# EAGLE design TOP_BEE_Brother_1.3v (EAGLE 6.5.0)
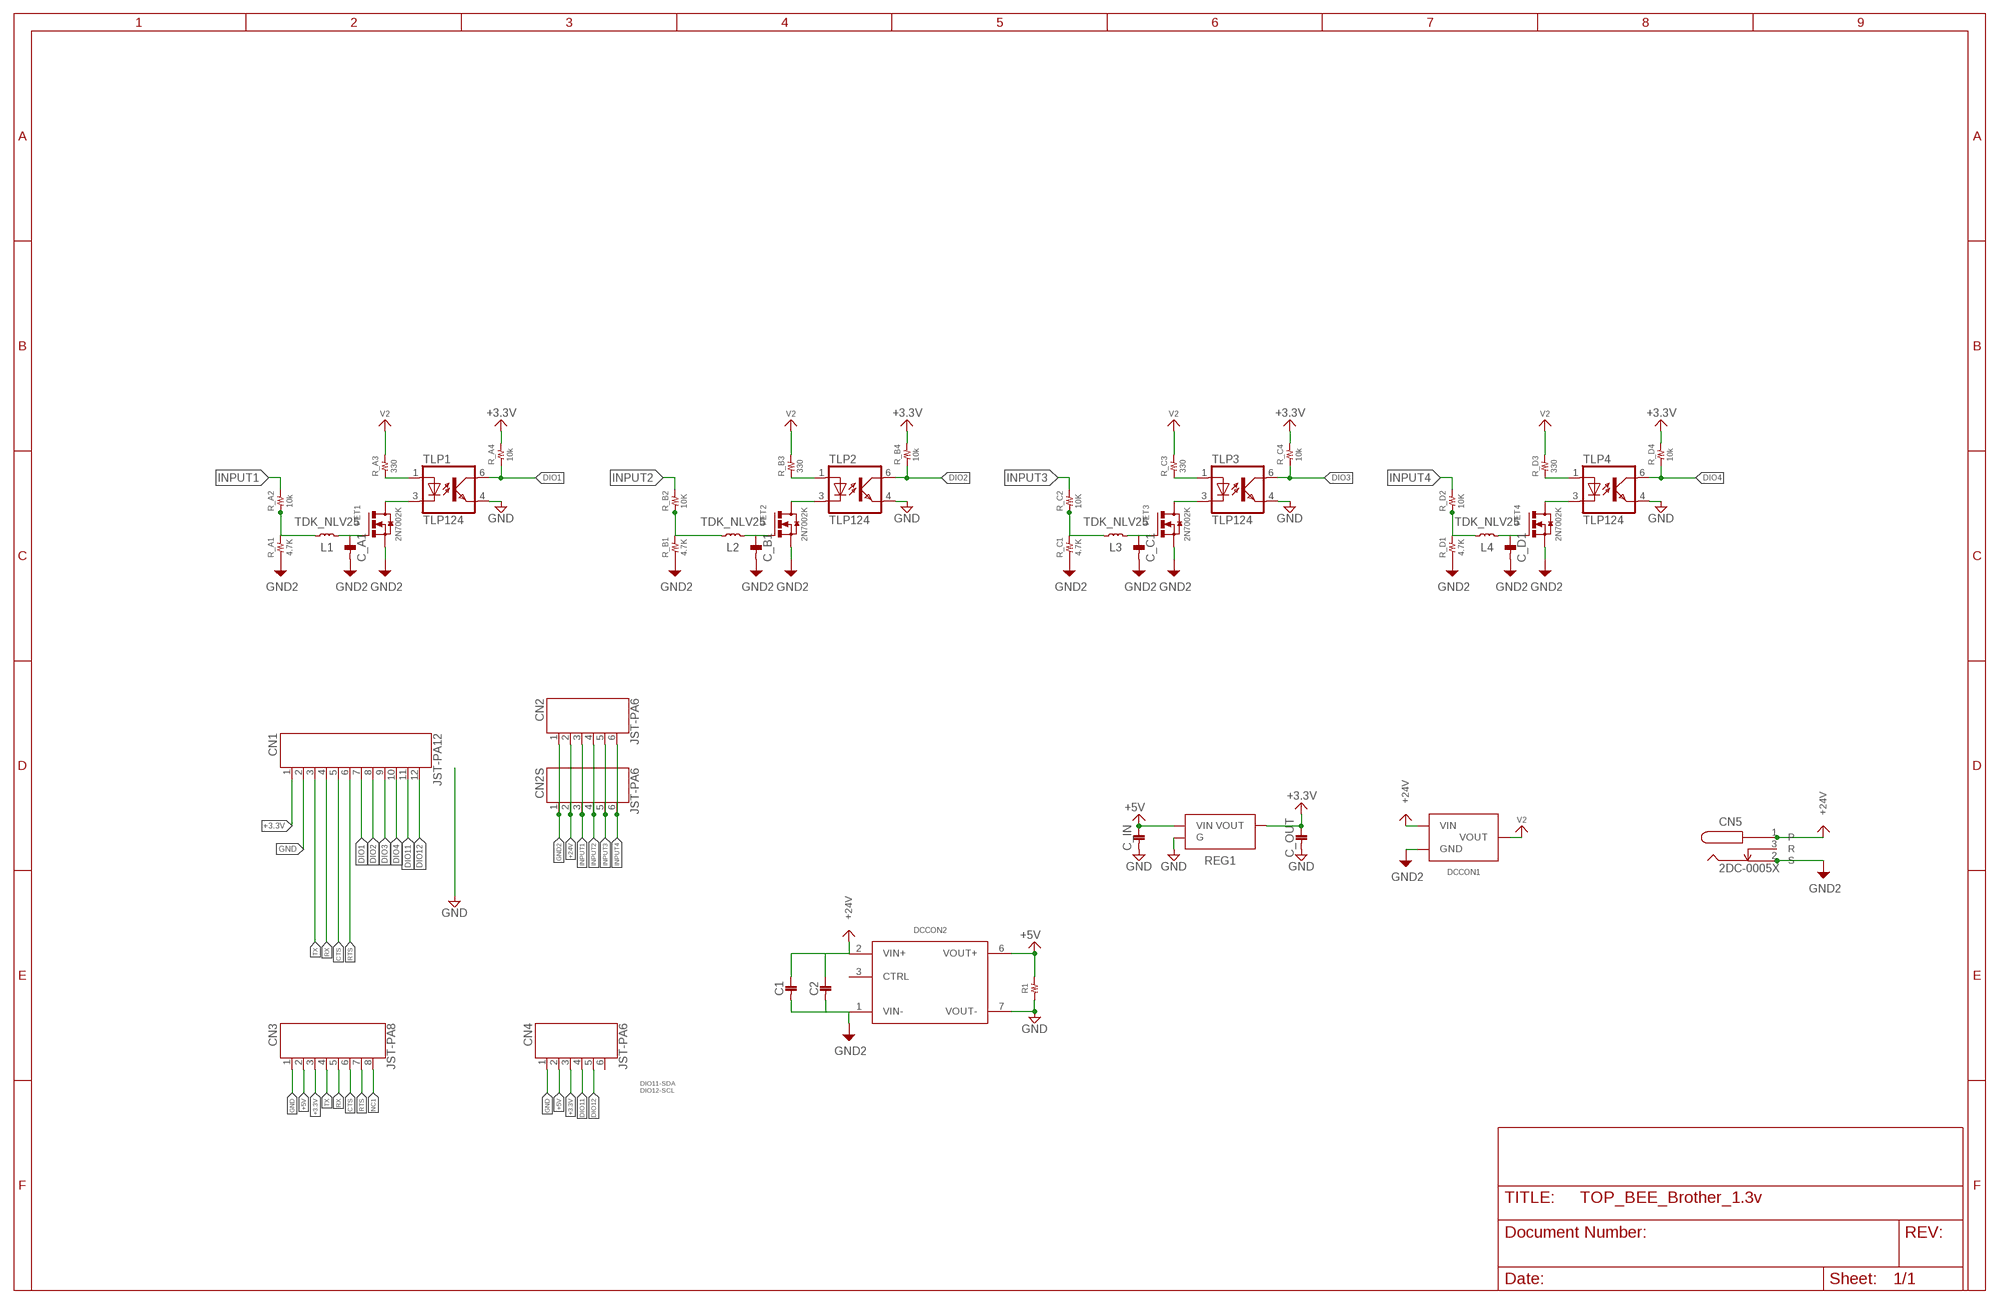
[diagram p0: schematic, sheet 1]

## Parts
C1  3225  [3225]
C2  1608  [1608]
C_A1  1608  [1608]
C_B1  1608  [1608]
C_C1  1608  [1608]
C_D1  1608  [1608]
C_IN  1608  [1608]
C_OUT  1608  [1608]
CN1  JST-PA12  [JST-PA12]
CN2  JST-PA6  [JST-PA6]
CN2S  JST-PA6  [JST-PA6]
CN3  JST-PA8  [JST-PA8]
CN4  JST-PA6  [JST-PA6]
CN5  2DC-0005X  [2DC-0005D]
DCCON1  Ｒ－７８Ｅ５．０  [Ｒ－７８Ｅ５．０]
DCCON2  RS3  [SIP8]
FET1  2N7002K  CHIP_FET  [SOT23]
FET2  2N7002K  CHIP_FET  [SOT23]
FET3  2N7002K  CHIP_FET  [SOT23]
FET4  2N7002K  CHIP_FET  [SOT23]
L1  TDK_NLV25  [TDK_NLV]
L2  TDK_NLV25  [TDK_NLV]
L3  TDK_NLV25  [TDK_NLV]
L4  TDK_NLV25  [TDK_NLV]
R1  RESISTOR__SMD  [1608]
R_A1  4.7K  RESISTOR__SMD  [1608]
R_A2  10k  RESISTOR__SMD  [1608]
R_A3  330  RESISTOR__SMD  [1608]
R_A4  10k  RESISTOR__SMD  [1608]
R_B1  4.7K  RESISTOR__SMD  [1608]
R_B2  10K  RESISTOR__SMD  [1608]
R_B3  330  RESISTOR__SMD  [1608]
R_B4  10k  RESISTOR__SMD  [1608]
R_C1  4.7K  RESISTOR__SMD  [1608]
R_C2  10K  RESISTOR__SMD  [1608]
R_C3  330  RESISTOR__SMD  [1608]
R_C4  10k  RESISTOR__SMD  [1608]
R_D1  4.7K  RESISTOR__SMD  [1608]
R_D2  10K  RESISTOR__SMD  [1608]
R_D3  330  RESISTOR__SMD  [1608]
R_D4  10k  RESISTOR__SMD  [1608]
REG1  NJM2845  [TO252]
TLP1  TLP124  [11−4C1]
TLP2  TLP124  [11−4C1]
TLP3  TLP124  [11−4C1]
TLP4  TLP124  [11−4C1]

## Nets
2N7002K: L1.P$1 R_A1.2 R_A2.1
+3.3V: C_OUT.P$1 CN1.1 CN3.3 CN4.3 R_A4.2 R_B4.2 R_C4.2 R_D4.2 REG1.3(VOUT)
+5V: C_IN.P$1 CN3.2 CN4.2 DCCON2.6(VOUT+) R1.2 REG1.1(VIN)
+24V [24v]: C1.P$1 C2.P$1 CN2.2 CN2S.2 CN5.1(P) DCCON1.1(VIN) DCCON2.2(VIN+)
CTS: CN1.5 CN3.6
DIO1: CN1.7 R_A4.1 TLP1.6(COL)
DIO2: CN1.8 R_B4.1 TLP2.6(COL)
DIO3: CN1.9 R_C4.1 TLP3.6(COL)
DIO4: CN1.10 R_D4.1 TLP4.6(COL)
DIO11: CN1.11 CN4.4
DIO12: CN1.12 CN4.5
GND: C_IN.P$2 C_OUT.P$2 CN1.2 CN3.1 CN4.1 DCCON2.7(VOUT-) R1.1 REG1.2(G) TLP1.4(EMIT) TLP2.4(EMIT) TLP3.4(EMIT) TLP4.4(EMIT)
GND2 [24v]: C1.P$2 C2.P$2 C_A1.P$2 C_B1.P$2 C_C1.P$2 C_D1.P$2 CN2.1 CN2S.1 CN5.2(S) DCCON1.2(GND) DCCON2.1(VIN-) FET1.2(S) FET2.2(S) FET3.2(S) FET4.2(S) R_A1.1 R_B1.1 R_C1.1 R_D1.1
INPUT1 [24vSig]: CN2.3 CN2S.3 R_A2.2
INPUT2 [24vSig]: CN2.4 CN2S.4 R_B2.2
INPUT3 [24vSig]: CN2.5 CN2S.5 R_C2.2
INPUT4 [24vSig]: CN2.6 CN2S.6 R_D2.2
N$1: FET2.3(D) TLP2.3(C)
N$2: FET1.3(D) TLP1.3(C)
N$3: R_A3.1 TLP1.1(A)
N$4: FET4.3(D) TLP4.3(C)
N$5: R_B3.1 TLP2.1(A)
N$6: L2.P$1 R_B1.2 R_B2.1
N$7: FET3.3(D) TLP3.3(C)
N$8: R_C3.1 TLP3.1(A)
N$9: L3.P$1 R_C1.2 R_C2.1
N$10: R_D3.1 TLP4.1(A)
N$11: L4.P$1 R_D1.2 R_D2.1
N$12: C_A1.P$1 FET1.1(G) L1.P$2
N$13: C_B1.P$1 FET2.1(G) L2.P$2
N$14: C_C1.P$1 FET3.1(G) L3.P$2
N$15: C_D1.P$1 FET4.1(G) L4.P$2
NC1: CN3.8
RTS: CN1.6 CN3.7
RX: CN1.4 CN3.5
TX: CN1.3 CN3.4
V2: DCCON1.3(VOUT) R_A3.2 R_B3.2 R_C3.2 R_D3.2
Unconnected: CN4.6 CN5.3(R) DCCON2.3(CTRL)

## Notes on the sheet
- DIO11-SDA
  DIO12-SCL

## Library data of the parts
C1 = 02_C:3225
C2 C_A1 C_B1 C_C1 C_D1 C_IN C_OUT = 02_C:1608
CN1 = jst-ph:JST-PA12
CN2 CN2S CN4 = jst-ph:JST-PA6
CN3 = jst-ph:JST-PA8
CN5 = marushin:2DC-0005X
DCCON1 = 04_IC:Ｒ－７８Ｅ５．０
DCCON2 = 04_IC:RS3
FET1-FET4 = 06_FET:CHIP_FET
L1-L4 = 03_L:TDK_NLV25
R1 R_A1-R_A4 R_B1-R_B4 R_C1-R_C4 R_D1-R_D4 = 01_R:RESISTOR__SMD
REG1 = 04_IC:NJM2845
TLP1-TLP4 = 04_IC:TLP124

## Net classes
0 default: width 0.2 mm
2 10v: width 0.008 mm
3 24vSig: clearance 0.4 mm to class 0

## Board
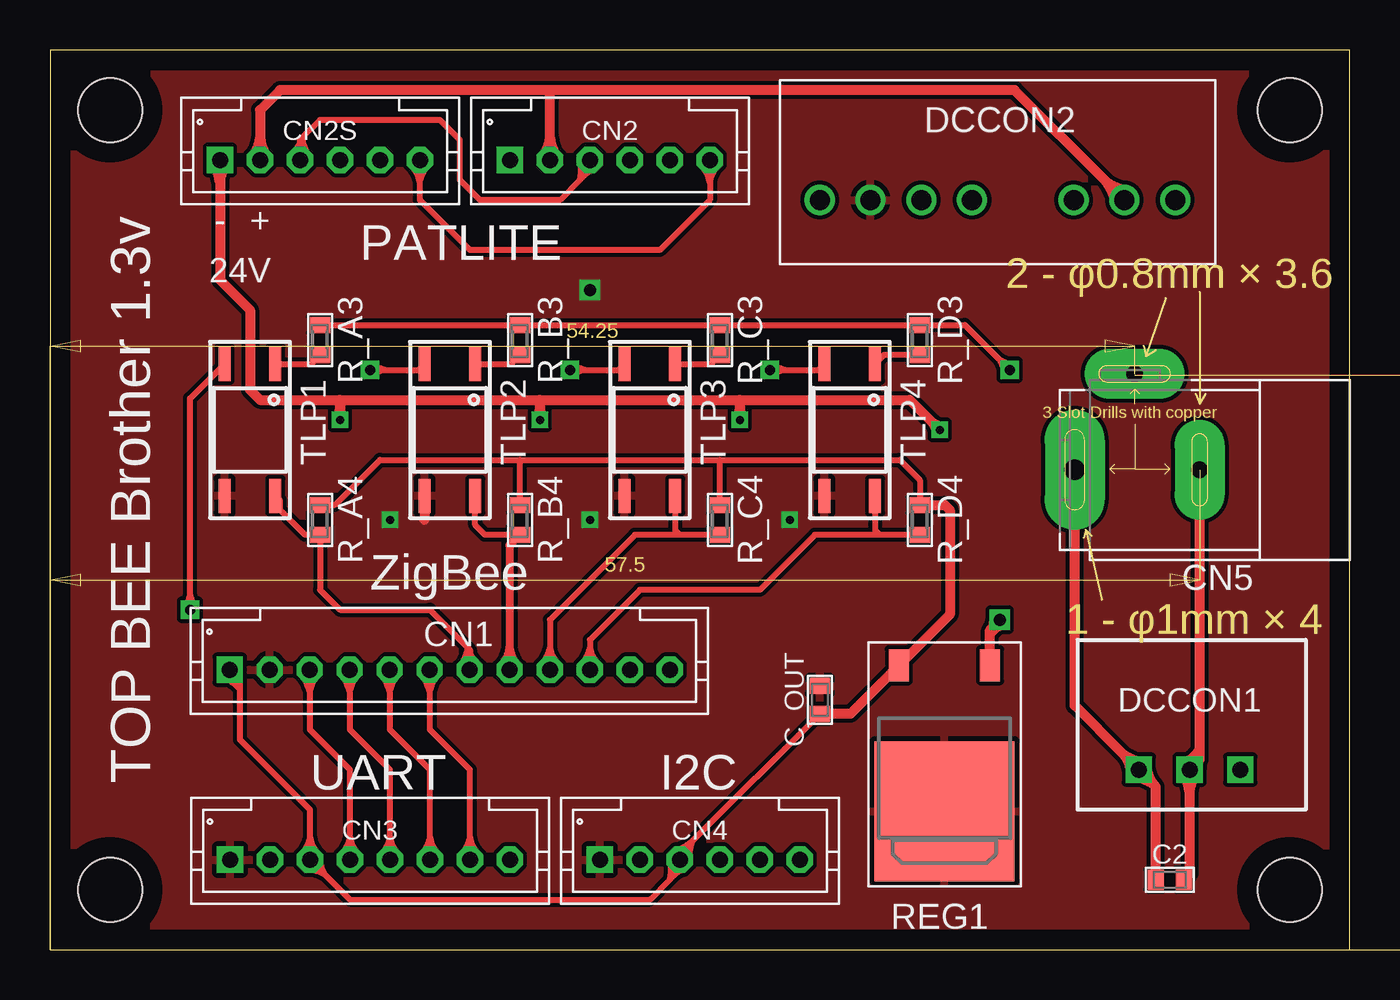
[diagram p1: board, top side]
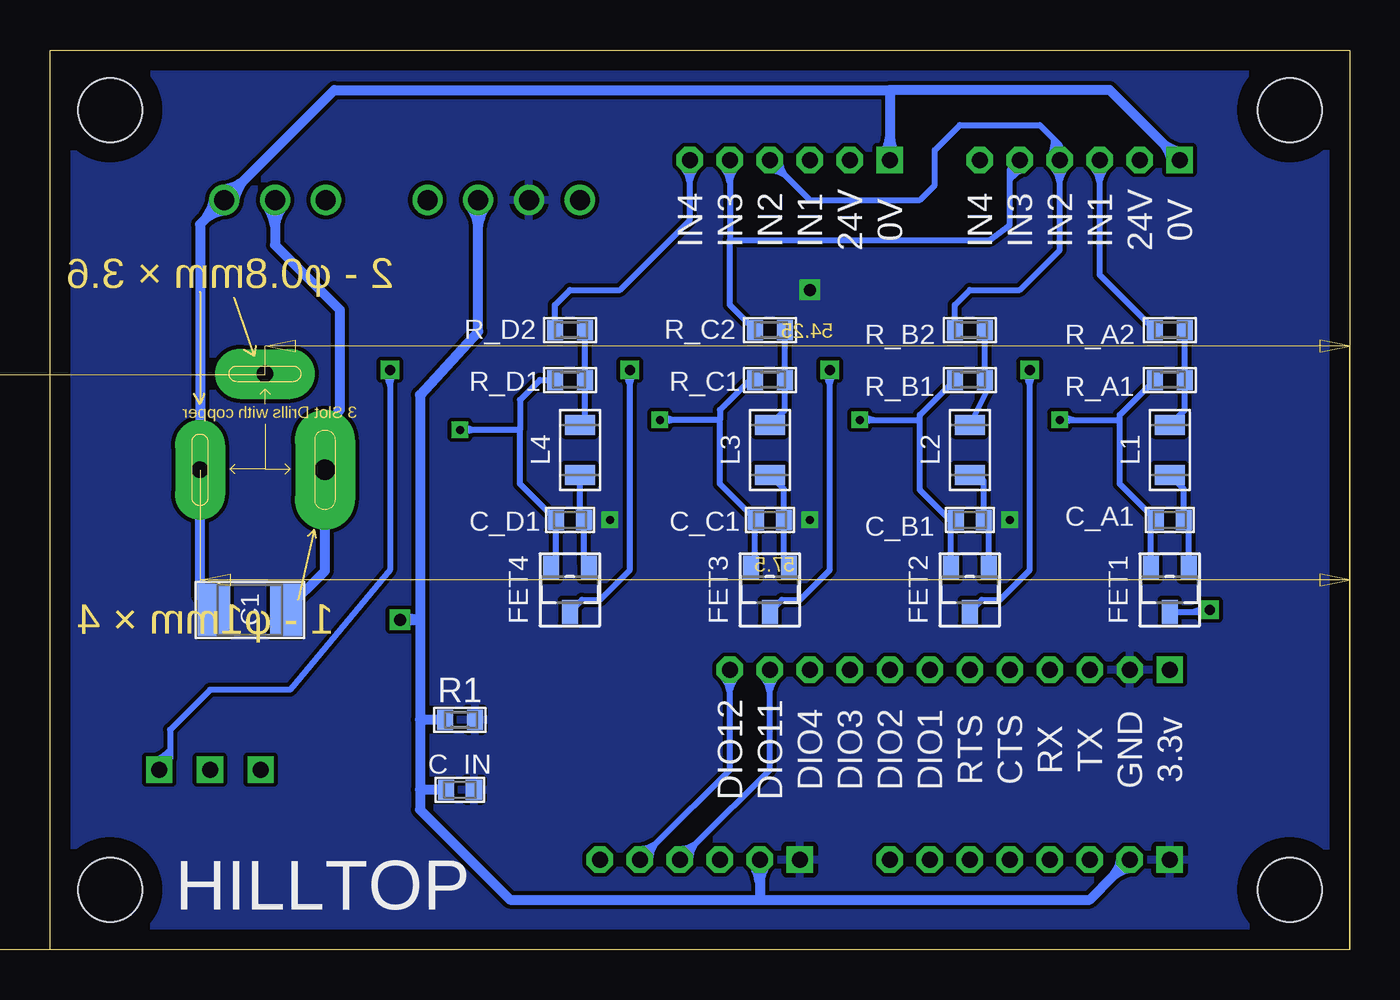
[diagram p2: board, bottom side, seen from below]

Size 65 x 45 mm. Coordinates in mm from the lower left corner, seen from the top.
Outline: 0,0 65,0 65,45 0,45 0,0
Copper layers (1*16): Top 0.035mm / dielectric 1.5mm / Bottom 0.035mm
Design rules "default *": minimum track width 10mil, minimum drill 0.4mm, track to track 8mil, track to pad 8mil, pad to pad 0.01mm, via to via 8mil, smd to smd 8mil, copper to edge 40mil, drill to drill 8mil, minimum pad ring 10mil, minimum via ring 8mil, stop-mask expansion 4mil, vias tented up to drill 0.5mm, thermal gap 10mil
Holes 3.2 mm at 3,42 62,42 62,3 3,3
Milling: area 0,18.2 to 1.5,18.8; area 56,18.2 to 57.5,18.8; area 27.6,18.9 to 29.9,19.6; area 71.4,0 to 72,1.5; area 71.4,27.2 to 72,28.8; area 70.5,12.9 to 71.2,15.8; area 0,29.9 to 1.5,30.5; area 52.8,29.9 to 54.2,30.5; area 25.7,30.6 to 28.6,31.3; 18 lines

### Footprints (pad centres in the part's own frame; a part is rotated, then mirrored left to right if it is on the bottom)
3225 = smd 1.6 x 2.6: P$1 -1.8,0; P$2 1.8,0
1608 = smd 0.8 x 1: P$1 -0.7,0; P$2 0.7,0
JST-PA12 = drill 0.8 square: 1 0.015,0 | drill 0.8 octagon: 2 -1.985,0; 3 -3.985,0; 4 -5.985,0; 5 -7.985,0; 6 -9.985,0; 7 -11.985,0; 8 -13.985,0; 9 -16,0; 10 -18,0; 11 -20,0; 12 -22,0
JST-PA6 = drill 0.8 square: 1 5,0 | drill 0.8 octagon: 2 3,0; 3 1,0; 4 -1,0; 5 -3,0; 6 -5,0
JST-PA8 = drill 0.8 square: 1 7,0 | drill 0.8 octagon: 2 5,0; 3 3,0; 4 1,0; 5 -1,0; 6 -3,0; 7 -5,0; 8 -7,0
2DC-0005D = drill 1.001 pad 3 long: 1 6.25,0 | drill 0.801 pad 2.5 long: 2 0,0; 3 3.25,-4.8
Ｒ－７８Ｅ５．０ = drill 0.8 square: 1 -2.54,0; 2 0,0; 3 2.54,0
SIP8 = drill 1: 1 -17.78,0; 2 -15.24,0; 3 -12.7,0; 5 -7.62,0; 6 -5.08,0; 7 -2.54,0; 8 0,0
SOT23 = smd 0.8 x 1.2: 1 -0.95,-1.1; 2 0.95,-1.1; 3 0,1.1
TDK_NLV = smd 1 x 1.5: P$1 1.25,0; P$2 -1.25,0
1608' = smd 0.8 x 1: 1 -0.75,0; 2 0.75,0
TO252 = smd 1 x 1.6: 1 -2.52,-6.22; 3 2.04,-6.22 | smd 7 x 7: 2 -0.24,1.08
11−4C1 = smd 0.6 x 1.7: 1 -1.27,-3.3; 3 1.27,-3.3; 4 1.27,3.3; 6 -1.27,3.3

### Placement (x,y rotation side)
C1  55,17 180 bottom
C2  56,3.5 0 top
C_A1  9,21.5 180 bottom
C_B1  19,21.5 180 bottom
C_C1  29,21.5 180 bottom
C_D1  39,21.5 180 bottom
C_IN  44.5,8 0 bottom
C_OUT  38.5,12.5 90 top
CN1  9,14 180 top
CN2  28,39.5 180 top
CN2S  13.5,39.5 180 top
CN3  16,4.5 180 top
CN4  32.5,4.5 180 top
CN5  57.5,24 180 top
DCCON1  57,9 0 top
DCCON2  38.5,37.5 180 top
DRILEGEND  [DRILEGEND]  -3.82,-12.1 0 top  (outside the outline)
FET1  9,18 180 bottom
FET2  19,18 180 bottom
FET3  29,18 180 bottom
FET4  39,18 180 bottom
L1  9,25 90 bottom
L2  19,25 90 bottom
L3  29,25 90 bottom
L4  38.5,25 90 bottom
R1  [1608']  44.5,11.5 180 bottom
R_A1  4.7K  [1608']  9,28.5 0 bottom
R_A2  10k  [1608']  9,31 180 bottom
R_A3  330  [1608']  13.5,30.5 90 top
R_A4  10k  [1608']  13.5,21.5 90 top
R_B1  4.7K  [1608']  19,28.5 0 bottom
R_B2  10K  [1608']  19,31 180 bottom
R_B3  330  [1608']  23.5,30.5 90 top
R_B4  10k  [1608']  23.5,21.5 90 top
R_C1  4.7K  [1608']  29,28.5 0 bottom
R_C2  10K  [1608']  29,31 180 bottom
R_C3  330  [1608']  33.5,30.5 90 top
R_C4  10k  [1608']  33.5,21.5 90 top
R_D1  4.7K  [1608']  39,28.5 0 bottom
R_D2  10K  [1608']  39,31 180 bottom
R_D3  330  [1608']  43.5,30.5 90 top
R_D4  10k  [1608']  43.5,21.5 90 top
REG1  44.5,8 180 top
TLP1  10,26 180 top
TLP2  20,26 180 top
TLP3  30,26 180 top
TLP4  40,26 180 top

### Tracks (layer width: path | path; a pad name or v marks a point on that pad's centre or on a via)
2N7002K
  Bottom 0.3: L1.P$1 8.25,27 R_A1.2 R_A2.1
+3.3V
  Top 0.3: R_A4.2 14.25,22.25 16.5,24.5 23.5,24.5 | R_D4.2 43.5,23.5 42.5,24.5 33.5,24.5 | 9.5,13.02 9.5,10.5 13,7 13,5.61 | 9.5,13.02 9.5,13.48 CN1.1 | C_OUT.P$1 32.12,5.42 | 32.12,5.42 31.5,4.8 CN4.3 | CN3.3 13.79,3.71 | 13.79,3.71 15,2.5 30,2.5 31,3.5 | 31,3.5 31.5,4 CN4.3 | CN3.3 13,5.61 | 23.5,24.5 33.5,24.5 | R_C4.2 33.5,24.5 | R_B4.2 23.5,24.5 | 13.79,3.71 arc-29 13.48,4.66 CN3.3 | 13.79,3.71 arc29 12.84,4.02 CN3.3 | 13,5.61 arc-29 12.55,4.73 CN3.3 | 13,5.61 arc29 13.45,4.73 CN3.3 | 32.12,5.42 arc-29 31.25,4.94 CN4.3 | 32.12,5.42 arc29 32,4.44 CN4.3 | 31,3.5 arc-29 31.8,4.09 CN4.3 | 31,3.5 arc29 31,4.5 CN4.3 | 9.5,13.02 arc-29 9.49,14.01 CN1.1 | 9.5,13.02 arc29 8.69,13.59 CN1.1
  Top 0.5: C_OUT.P$1 40.04,11.8 REG1.3 45,16.76 45,22 44.75,22.25 R_D4.2
+5V  (via drill 0.6)
  Top 0.5: REG1.1 47.02,15.79 | 47.02,15.79 47.02,15.98 v47.5,16.5 | 47.02,15.79 arc-29 47.66,16.3 v47.5,16.5 | 47.02,15.79 arc29 47.26,16.57 v47.5,16.5
  Bottom 0.5: 46.5,16.5 46.5,27.75 43.58,30.92 43.58,36.22 | 43.58,36.22 DCCON2.6 | v47.5,16.5 46.65,16.5 | 46.65,16.5 46.5,16.5 | 46.5,16.5 46.5,11.5 | 46.5,11.5 46.5,8 | 46.5,8 46.5,7 42,2.5 29.5,2.5 | 29.5,2.5 13,2.5 11.79,3.71 | 11.79,3.71 CN3.2 | CN4.2 29.5,3.39 | 29.5,3.39 29.5,2.5 | R1.2 46.5,11.5 | C_IN.P$1 46.5,8 | 46.65,16.5 arc-29 47.42,16.26 v47.5,16.5 | 46.65,16.5 arc29 47.42,16.74 v47.5,16.5 | 43.58,36.22 arc-29 44.04,37.3 DCCON2.6 | 43.58,36.22 arc29 43.12,37.3 DCCON2.6 | 11.79,3.71 arc-29 11.37,4.66 CN3.2 | 11.79,3.71 arc29 10.84,4.13 CN3.2 | 29.5,3.39 arc-29 29.88,4.35 CN4.2 | 29.5,3.39 arc29 29.12,4.35 CN4.2
+24V
  Top 0.5: DCCON1.1 55.25,8.21 | 55.25,8.21 55.3,8.16 C2.P$1 | DCCON1.1 53.67,9.79 | 53.67,9.79 51.25,12.21 CN5.1 | DCCON2.2 52.83,38.41 | 52.83,38.41 48.24,43 25,43 | 25,43 11.5,43 10.5,42 10.5,40.61 | 10.5,40.61 CN2S.2 | CN2.2 25,40.61 | 25,40.61 25,43 | 55.25,8.21 arc-29 54.83,9.16 DCCON1.1 | 55.25,8.21 arc29 54.3,8.63 DCCON1.1 | 53.67,9.79 arc-29 54.09,8.84 DCCON1.1 | 53.67,9.79 arc29 54.62,9.37 DCCON1.1 | 52.83,38.41 arc-29 53.27,37.31 DCCON2.2 | 52.83,38.41 arc29 53.93,37.97 DCCON2.2 | 25,40.61 arc-29 24.62,39.65 CN2.2 | 25,40.61 arc29 25.38,39.65 CN2.2 | 10.5,40.61 arc-29 10.12,39.65 CN2S.2 | 10.5,40.61 arc29 10.88,39.65 CN2S.2
  Bottom 0.5: C1.P$1 51.25,18.95 CN5.1 51.25,26.25 50.5,27 50.5,32 53.74,35.24 53.74,36.22 | DCCON2.2 53.74,36.22 | 53.74,36.22 arc-29 54.2,37.3 DCCON2.2 | 53.74,36.22 arc29 53.28,37.3 DCCON2.2
CTS
  Top 0.3: CN3.6 19,5.61 | 19,5.61 19,9 17,11 17,12.89 | 17,12.89 17,13.98 CN1.5 | 19,5.61 arc-29 18.55,4.73 CN3.6 | 19,5.61 arc29 19.45,4.73 CN3.6 | 17,12.89 arc-29 17.44,13.78 CN1.5 | 17,12.89 arc29 16.54,13.77 CN1.5
DIO1
  Top 0.3: TLP1.6 11.5,22.47 11.5,22 12.75,20.75 R_A4.1 13.5,18 14.5,17 19,17 20.89,15.11 | 20.89,15.11 21,15 21,14.02 CN1.7 | 20.89,15.11 arc-29 20.52,14.19 CN1.7 | 20.89,15.11 arc29 21.41,14.27 CN1.7
DIO2
  Top 0.3: R_B4.1 21.75,20.75 21.27,21.23 TLP2.6
  Top 0.406: R_B4.1 22.98,20.23 22.98,15.11 | 22.98,15.11 CN1.8 | 22.98,15.11 arc-29 22.57,14.18 CN1.8 | 22.98,15.11 arc29 23.4,14.18 CN1.8
DIO3
  Top 0.3: R_C4.1 31.5,20.75 | 31.5,20.75 29.25,20.75 25,16.5 25,15.11 | 25,15.11 CN1.9 | TLP3.6 31.27,20.98 31.5,20.75 | 25,15.11 arc-29 24.55,14.23 CN1.9 | 25,15.11 arc29 25.45,14.23 CN1.9
DIO4
  Top 0.3: R_D4.1 41.5,20.75 | 41.5,20.75 38.25,20.75 35.5,18 29.5,18 27,15.5 27,15.11 | 27,15.11 CN1.10 | TLP4.6 41.27,20.98 41.5,20.75 | 27,15.11 arc-29 26.55,14.23 CN1.10 | 27,15.11 arc29 27.45,14.23 CN1.10
DIO11
  Bottom 0.3: CN4.4 32.71,5.29 | 32.71,5.29 29,9 29,12.89 | 29,12.89 CN1.11 | 32.71,5.29 arc-29 33.02,4.34 CN4.4 | 32.71,5.29 arc29 33.66,4.98 CN4.4 | 29,12.89 arc-29 29.45,13.77 CN1.11 | 29,12.89 arc29 28.55,13.77 CN1.11
DIO12
  Bottom 0.3: CN4.5 34.71,5.29 | 34.71,5.29 31,9 31,12.89 | 31,12.89 CN1.12 | 34.71,5.29 arc-29 35.02,4.34 CN4.5 | 34.71,5.29 arc29 35.66,4.98 CN4.5 | 31,12.89 arc-29 31.45,13.77 CN1.12 | 31,12.89 arc29 30.55,13.77 CN1.12
GND  (via drill 0.4, 0.6)
  Top 0.5: TLP2.4 18.73,21.5
  other vias: 37,21.5 27,21.5 17,21.5 27,33
  pour Top: 0,45 65,45 65,0 0,0
  pour Bottom: 0,45 65,45 65,0 0,0
GND2  (via drill 0.4)
  Top 0.5: 57,7.89 57,3.8 C2.P$2 | 57,7.89 DCCON1.2 | DCCON1.2 57.5,9.5 57.5,9.99 | 57.5,9.99 CN5.2 | CN2S.1 8.5,38.39 | 8.5,38.39 8.5,33.5 10,32 10,28 10.5,27.5 14.5,27.5 | 14.5,27.5 24.5,27.5 | 24.5,27.5 34.5,27.5 | 34.5,27.5 43,27.5 44.02,26.48 | 44.02,26.48 v44.5,26 | v24.5,26.5 24.5,27.18 | 24.5,27.18 24.5,27.5 | v34.5,26.5 34.5,27.18 | 34.5,27.18 34.5,27.5 | 14.5,27.5 14.5,27.18 | 14.5,27.18 v14.5,26.5 | 44.02,26.48 arc-29 44.37,25.92 v44.5,26 | 44.02,26.48 arc29 44.58,26.13 v44.5,26 | 24.5,27.18 arc-29 24.35,26.53 v24.5,26.5 | 24.5,27.18 arc29 24.65,26.53 v24.5,26.5 | 34.5,27.18 arc-29 34.35,26.53 v34.5,26.5 | 34.5,27.18 arc29 34.65,26.53 v34.5,26.5 | 14.5,27.18 arc-29 14.35,26.53 v14.5,26.5 | 14.5,27.18 arc29 14.65,26.53 v14.5,26.5 | 57,7.89 arc-29 57.38,8.85 DCCON1.2 | 57,7.89 arc29 56.62,8.85 DCCON1.2 | 57.5,9.99 arc-29 56.73,9.3 DCCON1.2 | 57.5,9.99 arc29 57.4,8.96 DCCON1.2 | 8.5,38.39 arc-29 8.88,39.35 CN2S.1 | 8.5,38.39 arc29 8.12,39.35 CN2S.1
  Bottom 0.3: FET3.2 29.75,19.1 29.75,21.45 C_C1.P$2 31.5,23.3 31.5,26.5 | FET2.2 19.95,21.25 C_B1.P$2 20,21.5 21.5,23 21.5,26.5 | FET1.2 9.95,21.25 C_A1.P$2 11.5,23.3 11.5,26.5 | 11.5,26.5 11.5,26.75 R_A1.1 | v14.5,26.5 13.81,26.5 | 13.81,26.5 11.5,26.5 | 21.5,26.5 21.5,26.75 R_B1.1 | v24.5,26.5 23.82,26.5 | 23.82,26.5 21.5,26.5 | R_C1.1 30,28.5 31.5,27 31.5,26.5 | 31.5,26.5 33.81,26.5 | 33.81,26.5 v34.5,26.5 | 41.5,26 41.5,23.3 C_D1.P$2 39.7,19.35 FET4.2 | R_D1.1 40.5,28.5 41.5,27.5 41.5,26 | 41.5,26 43.81,26 | 43.81,26 v44.5,26 | 43.81,26 arc-29 44.41,25.77 v44.5,26 | 43.81,26 arc29 44.41,26.23 v44.5,26 | 23.82,26.5 arc-29 24.41,26.27 v24.5,26.5 | 23.82,26.5 arc29 24.41,26.73 v24.5,26.5 | 33.81,26.5 arc-29 34.41,26.27 v34.5,26.5 | 33.81,26.5 arc29 34.41,26.73 v34.5,26.5 | 13.81,26.5 arc-29 14.41,26.27 v14.5,26.5 | 13.81,26.5 arc29 14.41,26.73 v14.5,26.5
  Bottom 0.5: C1.P$2 57.5,17.7 CN5.2 57.5,36.28 57.19,36.59 | DCCON2.1 55.37,38.41 | 55.37,38.41 50.78,43 23,43 | 23,43 23,40.61 | 23,40.61 CN2.1 | CN2S.1 9.29,40.29 | 9.29,40.29 12,43 23,43 | DCCON2.1 57.19,36.59 | 55.37,38.41 arc-29 55.81,37.31 DCCON2.1 | 55.37,38.41 arc29 56.47,37.97 DCCON2.1 | 57.19,36.59 arc-29 56.75,37.69 DCCON2.1 | 57.19,36.59 arc29 56.09,37.03 DCCON2.1 | 23,40.61 arc-29 22.62,39.65 CN2.1 | 23,40.61 arc29 23.38,39.65 CN2.1 | 9.29,40.29 arc-29 8.34,39.87 CN2S.1 | 9.29,40.29 arc29 8.87,39.34 CN2S.1
INPUT1
  Top 0.3: 26.5,38.51 25.5,37.5 21.5,37.5 20.5,38.5 20.5,40.5 19.5,41.5 13.5,41.5 12.61,40.61 | 26.5,38.51 27,39 CN2.3 | CN2S.3 12.5,40.5 12.61,40.61 | 26.5,38.51 arc-29 27.3,39.09 CN2.3 | 26.5,38.51 arc29 26.5,39.5 CN2.3 | 12.61,40.61 arc-29 12.07,39.77 CN2S.3 | 12.61,40.61 arc29 12.97,39.68 CN2S.3
  Bottom 0.3: R_A2.2 12.5,33.75 12.5,38.39 | 12.5,38.39 CN2S.3 | 12.5,38.39 arc-29 12.95,39.27 CN2S.3 | 12.5,38.39 arc29 12.05,39.27 CN2S.3
INPUT2
  Bottom 0.3: R_B2.2 19.75,32.25 19,33 16.5,33 14.5,35 14.5,38.39 | 14.5,38.39 CN2S.4 | CN2.4 28.21,38.71 | 28.21,38.71 27,37.5 21.5,37.5 20.75,38.25 20.75,40 19.5,41.25 15.5,41.25 14.82,40.57 | 14.82,40.57 14.5,40.25 CN2S.4 | 28.21,38.71 arc-29 29.16,39.02 CN2.4 | 28.21,38.71 arc29 28.52,39.66 CN2.4 | 14.5,38.39 arc-29 14.95,39.27 CN2S.4 | 14.5,38.39 arc29 14.05,39.27 CN2S.4 | 14.82,40.57 arc-29 14.13,39.85 CN2S.4 | 14.82,40.57 arc29 15,39.59 CN2S.4
INPUT3
  Bottom 0.3: R_C2.2 31,32.25 31,35.5 | CN2.5 31,38.39 | 31,38.39 31,35.5 | 31,35.5 18,35.5 17,36.25 17,38.51 | 17,38.51 17,39 CN2S.5 | 31,38.39 arc-29 31.45,39.27 CN2.5 | 31,38.39 arc29 30.55,39.27 CN2.5 | 17,38.51 arc-29 17,39.5 CN2S.5 | 17,38.51 arc29 16.2,39.09 CN2S.5
INPUT4
  Top 0.3: CN2.6 33,38.39 | 33,38.39 33,37.5 30.5,35 21,35 18.5,37.5 18.5,38.39 | 18.5,38.39 CN2S.6 | 33,38.39 arc-29 33.45,39.27 CN2.6 | 33,38.39 arc29 32.55,39.27 CN2.6 | 18.5,38.39 arc-29 18.95,39.27 CN2S.6 | 18.5,38.39 arc29 18.05,39.27 CN2S.6
  Bottom 0.3: R_D2.2 39.75,32.25 39,33 36.5,33 33,36.5 33,38.39 | 33,38.39 CN2.6 | 33,38.39 arc-29 33.45,39.27 CN2.6 | 33,38.39 arc29 32.55,39.27 CN2.6
N$1  (via drill 0.5)
  Top 0.3: 18.73,29.23 TLP2.3 18.43,29 16.77,29 | v16,29 16.77,29 | 16.77,29 arc-29 16.12,29.28 v16,29 | 16.77,29 arc29 16.12,28.72 v16,29
  Bottom 0.3: FET2.3 18.4,17.5 17.5,17.5 16,19 16,28.23 | 16,28.23 v16,29 | 16,28.23 arc-29 16.28,28.88 v16,29 | 16,28.23 arc29 15.72,28.88 v16,29
N$2  (via drill 0.5)
  Top 0.3: v7,17 7,17.77 | 7,17.77 7,27.57 TLP1.3 | 7,17.77 arc-29 6.72,17.12 v7,17 | 7,17.77 arc29 7.28,17.12 v7,17
  Bottom 0.3: FET1.3 7.76,16.9 | 7.76,16.9 7.1,16.9 v7,17 | 7.76,16.9 arc-29 7.15,17.26 v7,17 | 7.76,16.9 arc29 7.08,16.71 v7,17
N$3
  Top 0.3: TLP1.1 13.05,29.3 R_A3.1
N$4  (via drill 0.5)
  Top 0.3: 38.73,29.23 TLP4.3 38.43,29 36.77,29 | v36,29 36.77,29 | 36.77,29 arc-29 36.12,29.28 v36,29 | 36.77,29 arc29 36.12,28.72 v36,29
  Bottom 0.3: FET4.3 38.4,17.5 37.5,17.5 36,19 36,28.23 | 36,28.23 v36,29 | 36,28.23 arc-29 36.28,28.88 v36,29 | 36,28.23 arc29 35.72,28.88 v36,29
N$5
  Top 0.3: TLP2.1 23.05,29.3 R_B3.1
N$6
  Bottom 0.3: L2.P$1 18,28.25 R_B1.2 R_B2.1
N$7  (via drill 0.5)
  Top 0.3: 28.73,29.23 TLP3.3 28.43,29 26.77,29 | v26,29 26.77,29 | 26.77,29 arc-29 26.12,29.28 v26,29 | 26.77,29 arc29 26.12,28.72 v26,29
  Bottom 0.3: FET3.3 28.4,17.5 27.5,17.5 26,19 26,28.23 | 26,28.23 v26,29 | 26,28.23 arc-29 26.28,28.88 v26,29 | 26,28.23 arc29 25.72,28.88 v26,29
N$8
  Top 0.3: TLP3.1 33.05,29.3 R_C3.1
N$9
  Bottom 0.3: L3.P$1 28.25,27 R_C1.2 R_C2.1
N$10
  Top 0.3: R_D3.1 41.72,29.75 TLP4.1
N$11
  Bottom 0.3: L4.P$1 38.25,26.5 R_D1.2 R_D2.1
N$12
  Bottom 0.3: FET1.1 8.05,21.25 C_A1.P$1 8.3,23.05 L1.P$2
N$13
  Bottom 0.3: FET2.1 18.05,21.25 C_B1.P$1 18.3,23.45 L2.P$2
N$14
  Bottom 0.3: FET3.1 28.3,19.35 C_C1.P$1 28.3,23.05 L3.P$2
N$15
  Bottom 0.3: FET4.1 38.3,19.35 C_D1.P$1 38.5,21.7 L4.P$2
RTS
  Top 0.3: CN3.7 21,5.61 | 21,5.61 21,9 19,11 19,12.89 | 19,12.89 19,13.98 CN1.6 | 21,5.61 arc-29 20.55,4.73 CN3.7 | 21,5.61 arc29 21.45,4.73 CN3.7 | 19,12.89 arc-29 19.44,13.78 CN1.6 | 19,12.89 arc29 18.54,13.77 CN1.6
RX
  Top 0.3: CN3.5 17,5.61 | 17,5.61 17,9 15,11 15,12.89 | 15,12.89 15,13.98 CN1.4 | 17,5.61 arc-29 16.55,4.73 CN3.5 | 17,5.61 arc29 17.45,4.73 CN3.5 | 15,12.89 arc-29 15.44,13.78 CN1.4 | 15,12.89 arc29 14.54,13.77 CN1.4
TX
  Top 0.3: CN3.4 15,5.61 | 15,5.61 15,9 13,11 13,12.89 | 13,12.89 13,13.98 CN1.3 | 15,5.61 arc-29 14.55,4.73 CN3.4 | 15,5.61 arc29 15.45,4.73 CN3.4 | 13,12.89 arc-29 13.44,13.78 CN1.3 | 13,12.89 arc29 12.54,13.77 CN1.3
V2  (via drill 0.5)
  Top 0.3: R_A3.2 R_B3.2 R_C3.2 R_D3.2 45.75,31.25 47.45,29.55 | 47.45,29.55 v48,29 | 47.45,29.55 arc-29 47.72,28.89 v48,29 | 47.45,29.55 arc29 48.11,29.28 v48,29
  Bottom 0.3: 59,9.97 59,11 57,13 53,13 48,19 48,28.23 | 59,9.97 59,9.54 DCCON1.3 | v48,29 48,28.23 | 48,28.23 arc-29 48.28,28.88 v48,29 | 48,28.23 arc29 47.72,28.88 v48,29 | 59,9.97 arc-29 59.04,8.98 DCCON1.3 | 59,9.97 arc29 59.82,9.42 DCCON1.3

### Text on the board
tPlace: - | + | 24V | PATLITE | TOP BEE Brother 1.3v | ZigBee | UART | I2C
bPlace: 0V | 24V | IN1 | IN2 | IN3 | IN4 | 0V | 24V | IN1 | IN2 | IN3 | IN4 | 3.3v | GND | TX | RX | CTS | RTS | DIO1 | DIO2 | DIO3 | DIO4 | DIO11 | DIO12 | HILLTOP
Milling: 2 - φ0.8mm × 3.6 | 1 - φ1mm × 4
DrillLegend_01-20: 穴図